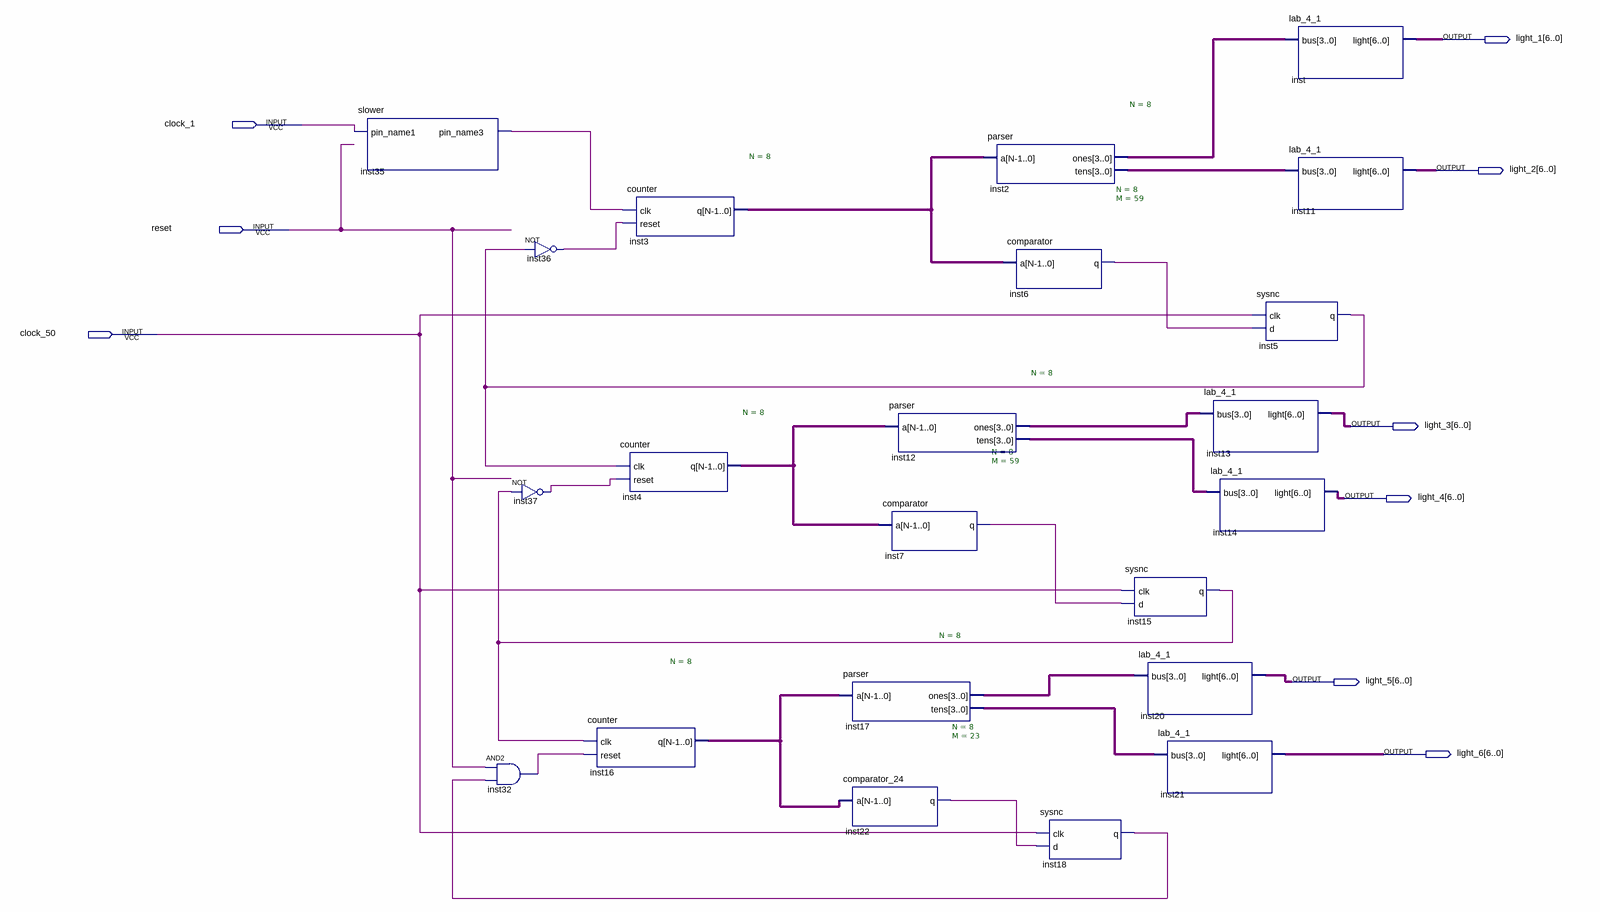
[diagram p0: schematic sheet]
// Quartus schematic lab_51 - Copy.bdf as structural Verilog: 22 symbols, 9 pins
module \lab_51_-_Copy  (
  input  clock_1,
  input  reset,
  input  clock_50,
  output [6:0] light_1,
  output [6:0] light_2,
  output [6:0] light_3,
  output [6:0] light_4,
  output [6:0] light_5,
  output [6:0] light_6
);

  wire inst5_q, inst6_q, inst7_q, inst15_q, inst18_q, inst22_q, inst32_out, inst35_pin_name3, inst36_out,
       inst37_out;
  wire [3:0] inst2_ones, inst2_tens, inst12_ones, inst12_tens, inst17_ones, inst17_tens;
  wire [7:0] inst3_q, inst4_q, inst16_q;

  slower inst35 (.pin_name1(clock_1), .pin_name3(inst35_pin_name3));
  and inst32 (inst32_out, reset, inst18_q);
  not inst36 (inst36_out, inst5_q);
  not inst37 (inst37_out, inst15_q);
  counter #(.N(8)) inst16 (.clk(inst15_q), .reset(inst32_out), .q(inst16_q));
  counter #(.N(8)) inst3 (.clk(inst35_pin_name3), .reset(inst36_out), .q(inst3_q));
  counter #(.N(8)) inst4 (.clk(inst5_q), .reset(inst37_out), .q(inst4_q));
  parser #(.N(8)) inst17 (.a(inst16_q), .ones(inst17_ones), .tens(inst17_tens));
  comparator_24 #(.N(8), .M(23)) inst22 (.a(inst16_q), .q(inst22_q));
  parser #(.N(8)) inst12 (.a(inst4_q), .ones(inst12_ones), .tens(inst12_tens));
  comparator #(.N(8), .M(59)) inst7 (.a(inst4_q), .q(inst7_q));
  parser #(.N(8)) inst2 (.a(inst3_q), .ones(inst2_ones), .tens(inst2_tens));
  comparator #(.N(8), .M(59)) inst6 (.a(inst3_q), .q(inst6_q));
  sysnc inst18 (.clk(clock_50), .d(inst22_q), .q(inst18_q));
  sysnc inst15 (.clk(clock_50), .d(inst7_q), .q(inst15_q));
  lab_4_1 inst20 (.bus(inst17_ones), .light(light_5));
  lab_4_1 inst21 (.bus(inst17_tens), .light(light_6));
  lab_4_1 inst13 (.bus(inst12_ones), .light(light_3));
  lab_4_1 inst14 (.bus(inst12_tens), .light(light_4));
  sysnc inst5 (.clk(clock_50), .d(inst6_q), .q(inst5_q));
  lab_4_1 inst (.bus(inst2_ones), .light(light_1));
  lab_4_1 inst11 (.bus(inst2_tens), .light(light_2));
endmodule
